# EAGLE design nitwhips_v1.0a (EAGLE 5.09)
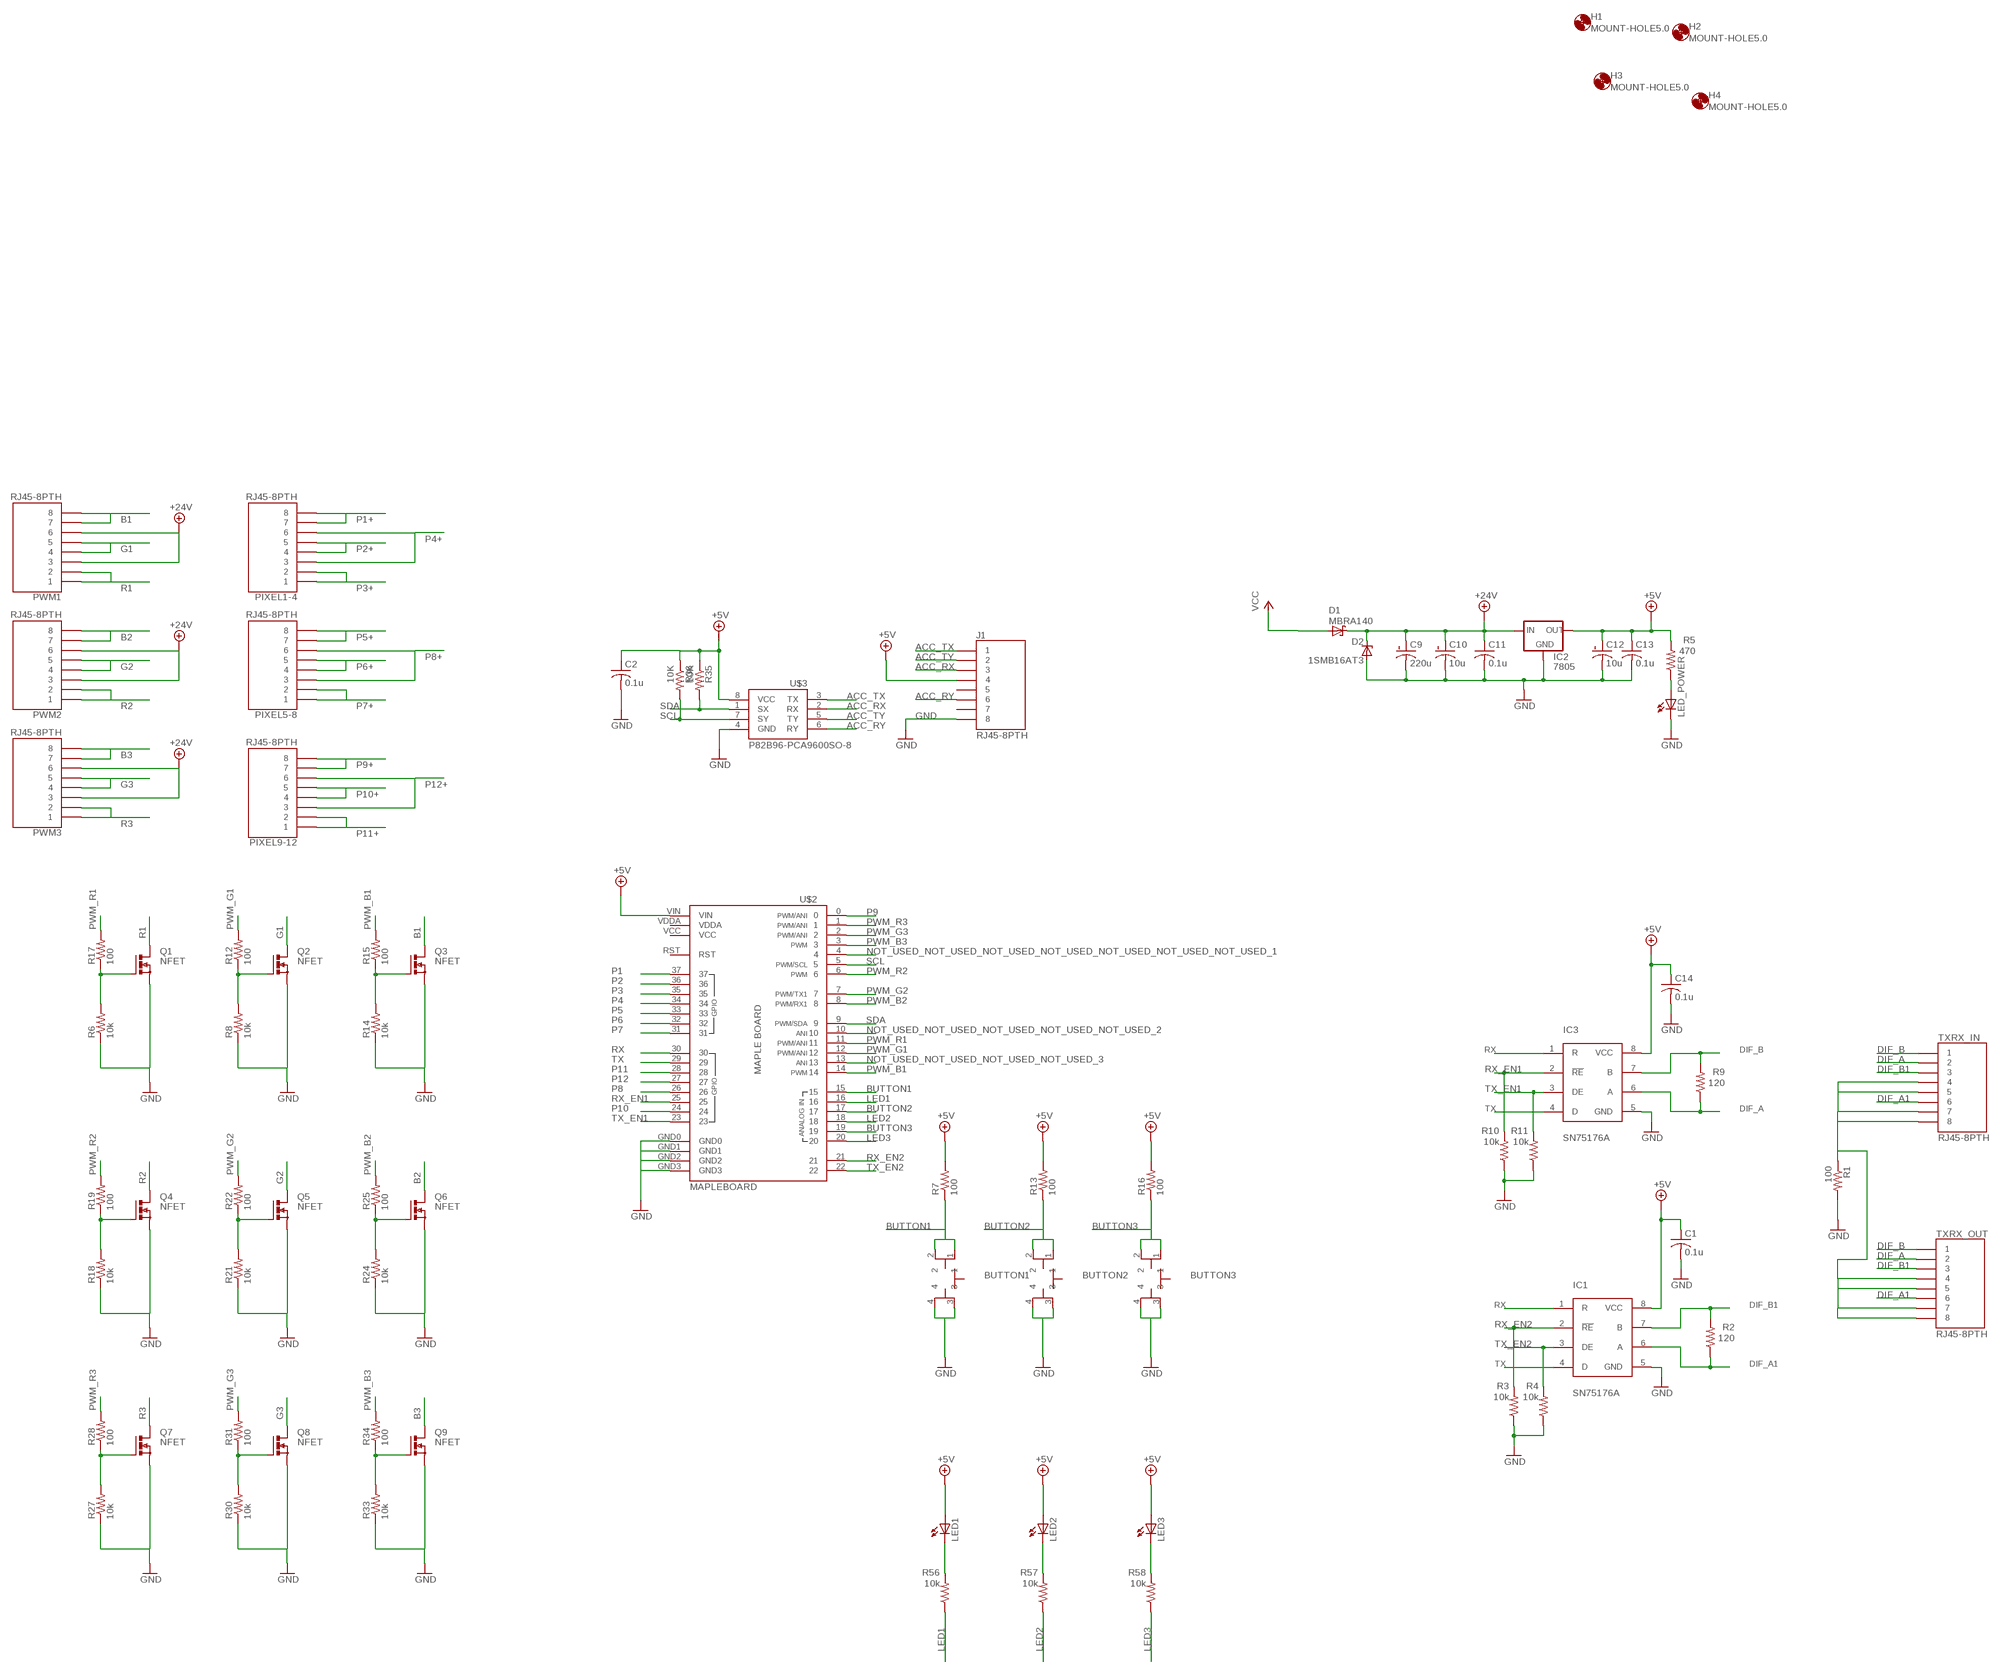
[diagram p0: schematic, sheet 1, part 1 of 2]
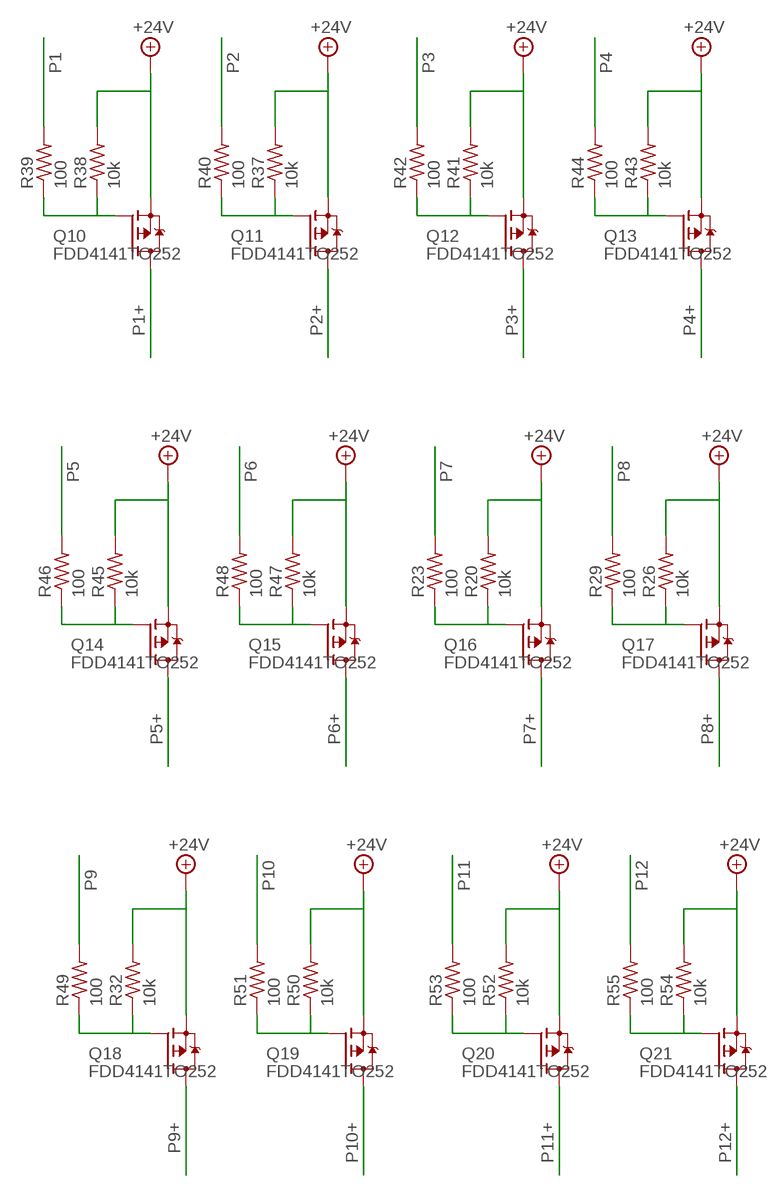
[diagram p1: schematic, sheet 1, part 2 of 2]

## Parts
BUTTON1  TL3301  [TL3301]
BUTTON2  TL3301  [TL3301]
BUTTON3  TL3301  [TL3301]
C1  0.1u  C-USC0805  [C0805]
C2  0.1u  C-USC0805  [C0805]
C9  220u  CPOL-USG  [PANASONIC_G]
C10  10u  CPOL-USCT6032  [CT6032]
C11  0.1u  C-USC0805  [C0805]
C12  10u  CPOL-USCT6032  [CT6032]
C13  0.1u  C-USC0805  [C0805]
C14  0.1u  C-USC0805  [C0805]
D1  MBRA140  [SMA]
D2  1SMB16AT3  ZENER-DIODESMB  [SMB]
H1  MOUNT-HOLE5.0  [5,0]
H2  MOUNT-HOLE5.0  [5,0]
H3  MOUNT-HOLE5.0  [5,0]
H4  MOUNT-HOLE5.0  [5,0]
IC1  SN75176A  [SO-08]
IC2  7805  LP2950CDT-5.0  [DPACK]
IC3  SN75176A  [SO-08]
J1  RJ45-8PTH  [RJ45-8]
LED1  LEDCHIP-LED0805  [CHIP-LED0805]
LED2  LEDCHIP-LED0805  [CHIP-LED0805]
LED3  LEDCHIP-LED0805  [CHIP-LED0805]
LED_POWER  LEDCHIP-LED0805  [CHIP-LED0805]
PIXEL1-4  RJ45-8PTH  [RJ45-8]
PIXEL5-8  RJ45-8PTH  [RJ45-8]
PIXEL9-12  RJ45-8PTH  [RJ45-8]
PWM1  RJ45-8PTH  [RJ45-8]
PWM2  RJ45-8PTH  [RJ45-8]
PWM3  RJ45-8PTH  [RJ45-8]
Q1  NFET  [TO252]
Q2  NFET  [TO252]
Q3  NFET  [TO252]
Q4  NFET  [TO252]
Q5  NFET  [TO252]
Q6  NFET  [TO252]
Q7  NFET  [TO252]
Q8  NFET  [TO252]
Q9  NFET  [TO252]
Q10  FDD4141TO252  [TO252]
Q11  FDD4141TO252  [TO252]
Q12  FDD4141TO252  [TO252]
Q13  FDD4141TO252  [TO252]
Q14  FDD4141TO252  [TO252]
Q15  FDD4141TO252  [TO252]
Q16  FDD4141TO252  [TO252]
Q17  FDD4141TO252  [TO252]
Q18  FDD4141TO252  [TO252]
Q19  FDD4141TO252  [TO252]
Q20  FDD4141TO252  [TO252]
Q21  FDD4141TO252  [TO252]
R1  100  R-US_R2512  [R2512]
R2  120  R-US_R0805  [R0805]
R3  10k  R-US_R0805  [R0805]
R4  10k  R-US_R0805  [R0805]
R5  470  R-US_R0805  [R0805]
R6  10k  R-US_R0603  [R0603]
R7  100  R-US_R0603  [R0603]
R8  10k  R-US_R0603  [R0603]
R9  120  R-US_R0805  [R0805]
R10  10k  R-US_R0805  [R0805]
R11  10k  R-US_R0805  [R0805]
R12  100  R-US_R0603  [R0603]
R13  100  R-US_R0603  [R0603]
R14  10k  R-US_R0603  [R0603]
R15  100  R-US_R0603  [R0603]
R16  100  R-US_R0603  [R0603]
R17  100  R-US_R0603  [R0603]
R18  10k  R-US_R0603  [R0603]
R19  100  R-US_R0603  [R0603]
R20  10k  R-US_R0603  [R0603]
R21  10k  R-US_R0603  [R0603]
R22  100  R-US_R0603  [R0603]
R23  100  R-US_R0603  [R0603]
R24  10k  R-US_R0603  [R0603]
R25  100  R-US_R0603  [R0603]
R26  10k  R-US_R0603  [R0603]
R27  10k  R-US_R0603  [R0603]
R28  100  R-US_R0603  [R0603]
R29  100  R-US_R0603  [R0603]
R30  10k  R-US_R0603  [R0603]
R31  100  R-US_R0603  [R0603]
R32  10k  R-US_R0603  [R0603]
R33  10k  R-US_R0603  [R0603]
R34  100  R-US_R0603  [R0603]
R35  10K  R-US_R0603  [R0603]
R36  10K  R-US_R0603  [R0603]
R37  10k  R-US_R0603  [R0603]
R38  10k  R-US_R0603  [R0603]
R39  100  R-US_R0603  [R0603]
R40  100  R-US_R0603  [R0603]
R41  10k  R-US_R0603  [R0603]
R42  100  R-US_R0603  [R0603]
R43  10k  R-US_R0603  [R0603]
R44  100  R-US_R0603  [R0603]
R45  10k  R-US_R0603  [R0603]
R46  100  R-US_R0603  [R0603]
R47  10k  R-US_R0603  [R0603]
R48  100  R-US_R0603  [R0603]
R49  100  R-US_R0603  [R0603]
R50  10k  R-US_R0603  [R0603]
R51  100  R-US_R0603  [R0603]
R52  10k  R-US_R0603  [R0603]
R53  100  R-US_R0603  [R0603]
R54  10k  R-US_R0603  [R0603]
R55  100  R-US_R0603  [R0603]
R56  10k  R-US_R0805  [R0805]
R57  10k  R-US_R0805  [R0805]
R58  10k  R-US_R0805  [R0805]
TXRX_IN  RJ45-8PTH  [RJ45-8]
TXRX_OUT  RJ45-8PTH  [RJ45-8]
U$2  MAPLEBOARD  [MAPLEBOARD]
U$3  P82B96-PCA9600SO-8  [SO-8]

## Nets
+5V: C1.1 C2.1 C12.+ C13.1 C14.1 IC1.8(VCC) IC2.3(OUT) IC3.8(VCC) J1.4 LED1.A LED2.A LED3.A R5.2 R7.2 R13.2 R16.2 R35.1 R36.1 U$2.VIN U$3.8(VCC)
+24V: C9.+ C10.+ C11.1 D1.K(C) D2.C IC2.1(IN) PWM1.3 PWM1.6 PWM2.3 PWM2.6 PWM3.3 PWM3.6 Q10.3(S) Q11.3(S) Q12.3(S) Q13.3(S) Q14.3(S) Q15.3(S) Q16.3(S) Q17.3(S) Q18.3(S) Q19.3(S) Q20.3(S) Q21.3(S) R20.2 R26.2 R32.2 R37.2 R38.2 R41.2 R43.2 R45.2 R47.2 R50.2 R52.2 R54.2
ACC_RX: J1.3 U$3.2(RX)
ACC_RY: J1.6 U$3.6(RY)
ACC_TX: J1.1 U$3.3(TX)
ACC_TY: J1.2 U$3.5(TY)
B1: PWM1.7 PWM1.8 Q3.2(D)
B2: PWM2.7 PWM2.8 Q6.2(D)
B3: PWM3.7 PWM3.8 Q9.2(D)
BUTTON1: BUTTON1.1 BUTTON1.2 R7.1 U$2.15
BUTTON2: BUTTON2.1 BUTTON2.2 R13.1 U$2.17
BUTTON3: BUTTON3.1 BUTTON3.2 R16.1 U$2.19
DIF_A: IC3.6(A) R9.1 TXRX_IN.2 TXRX_OUT.2
DIF_A1: IC1.6(A) R2.1 TXRX_IN.6 TXRX_OUT.6
DIF_B: IC3.7(B) R9.2 TXRX_IN.1 TXRX_OUT.1
DIF_B1: IC1.7(B) R2.2 TXRX_IN.3 TXRX_OUT.3
G1: PWM1.4 PWM1.5 Q2.2(D)
G2: PWM2.4 PWM2.5 Q5.2(D)
G3: PWM3.4 PWM3.5 Q8.2(D)
GND: BUTTON1.3 BUTTON1.4 BUTTON2.3 BUTTON2.4 BUTTON3.3 BUTTON3.4 C1.2 C2.2 C9.- C10.- C11.2 C12.- C13.2 C14.2 D2.A IC1.5(GND) IC2.4(GND) IC3.5(GND) J1.8 LED_POWER.C Q1.3(S) Q2.3(S) Q3.3(S) Q4.3(S) Q5.3(S) Q6.3(S) Q7.3(S) Q8.3(S) Q9.3(S) R1.2 R3.1 R4.1 R6.1 R8.1 R10.1 R11.1 R14.1 R18.1 R21.1 R24.1 R27.1 R30.1 R33.1 U$2.GND0 U$2.GND1 U$2.GND2 U$2.GND3 U$3.4(GND)
LED1: R56.1 U$2.16
LED2: R57.1 U$2.18
LED3: R58.1 U$2.20
N$1: LED_POWER.A R5.1
N$2: Q2.1(G) R8.2 R12.1
N$3: Q18.1(G) R32.1 R49.1
N$4: R1.1 TXRX_IN.4 TXRX_IN.5 TXRX_IN.7 TXRX_IN.8 TXRX_OUT.4 TXRX_OUT.5 TXRX_OUT.7 TXRX_OUT.8
N$6: Q19.1(G) R50.1 R51.1
N$8: Q3.1(G) R14.2 R15.1
N$9: Q20.1(G) R52.1 R53.1
N$10: Q4.1(G) R18.2 R19.1
N$11: LED1.C R56.2
N$12: Q5.1(G) R21.2 R22.1
N$13: Q16.1(G) R20.1 R23.1
N$14: Q6.1(G) R24.2 R25.1
N$15: Q17.1(G) R26.1 R29.1
N$16: Q7.1(G) R27.2 R28.1
N$17: Q21.1(G) R54.1 R55.1
N$18: Q8.1(G) R30.2 R31.1
N$19: Q1.1(G) R6.2 R17.1
N$20: LED2.C R57.2
N$21: Q9.1(G) R33.2 R34.1
N$22: Q11.1(G) R37.1 R40.1
N$23: Q12.1(G) R41.1 R42.1
N$24: Q10.1(G) R38.1 R39.1
N$25: Q13.1(G) R43.1 R44.1
N$26: Q14.1(G) R45.1 R46.1
N$27: Q15.1(G) R47.1 R48.1
N$28: LED3.C R58.2
NOT_USED_NOT_USED_NOT_USED_NOT_USED_3: U$2.13
NOT_USED_NOT_USED_NOT_USED_NOT_USED_NOT_USED_2: U$2.10
NOT_USED_NOT_USED_NOT_USED_NOT_USED_NOT_USED_NOT_USED_NOT_USED_1: U$2.4
P1: R39.2 U$2.37
P1+: PIXEL1-4.7 PIXEL1-4.8 Q10.2(D)
P2: R40.2 U$2.36
P2+: PIXEL1-4.4 PIXEL1-4.5 Q11.2(D)
P3: R42.2 U$2.35
P3+: PIXEL1-4.1 PIXEL1-4.2 Q12.2(D)
P4: R44.2 U$2.34
P4+: PIXEL1-4.3 PIXEL1-4.6 Q13.2(D)
P5: R46.2 U$2.33
P5+: PIXEL5-8.7 PIXEL5-8.8 Q14.2(D)
P6: R48.2 U$2.32
P6+: PIXEL5-8.4 PIXEL5-8.5 Q15.2(D)
P7: R23.2 U$2.31
P7+: PIXEL5-8.1 PIXEL5-8.2 Q16.2(D)
P8: R29.2 U$2.26
P8+: PIXEL5-8.3 PIXEL5-8.6 Q17.2(D)
P9: R49.2 U$2.0
P9+: PIXEL9-12.7 PIXEL9-12.8 Q18.2(D)
P10: R51.2 U$2.24
P10+: PIXEL9-12.4 PIXEL9-12.5 Q19.2(D)
P11: R53.2 U$2.28
P11+: PIXEL9-12.1 PIXEL9-12.2 Q20.2(D)
P12: R55.2 U$2.27
P12+: PIXEL9-12.3 PIXEL9-12.6 Q21.2(D)
PWM_B1: R15.2 U$2.14
PWM_B2: R25.2 U$2.8
PWM_B3: R34.2 U$2.3
PWM_G1: R12.2 U$2.12
PWM_G2: R22.2 U$2.7
PWM_G3: R31.2 U$2.2
PWM_R1: R17.2 U$2.11
PWM_R2: R19.2 U$2.6
PWM_R3: R28.2 U$2.1
R1: PWM1.1 PWM1.2 Q1.2(D)
R2: PWM2.1 PWM2.2 Q4.2(D)
R3: PWM3.1 PWM3.2 Q7.2(D)
RX: IC1.1(R) IC3.1(R) U$2.30
RX_EN1: IC3.2(!RE) R10.2 U$2.25
RX_EN2: IC1.2(!RE) R3.2 U$2.21
SCL: R36.2 U$2.5 U$3.7(SY)
SDA: R35.2 U$2.9 U$3.1(SX)
TX: IC1.4(D) IC3.4(D) U$2.29
TX_EN1: IC3.3(DE) R11.2 U$2.23
TX_EN2: IC1.3(DE) R4.2 U$2.22
VCC: D1.A
Unconnected: J1.5 J1.7 U$2.RST U$2.VCC U$2.VDDA

## Library data of the parts
BUTTON1-BUTTON3 = E-switch:TL3301
C1 C2 C11 C13 C14 = rcl:C-US: CAPACITOR, American symbol
C9 C10 C12 = rcl:CPOL-US: POLARIZED CAPACITOR, American symbol
D1 = diode:MBRA140
D2 = diode:ZENER-DIODE: Z-Diode
H1-H4 = holes:MOUNT-HOLE: MOUNTING HOLE with drill center marker
IC1 IC3 = texas:SN75176A: Transceiver RS422
IC2 = v-reg:LP2950?*: Source: http://cache.national.com/ds/LP/LP2950.pdf
J1 PIXEL1-4 PIXEL5-8 PIXEL9-12 PWM1-PWM3 TXRX_IN TXRX_OUT = SparkFun:RJ45-8: RJ45 Jack Simple RJ45, 8-pin connection - connector for common Cat5, Cat5e, and Cat6 Ethernet cables. Footprint not yet proven in production. Connector sku is PRT-00643; Breakout PCB sku is BOB-00716.
LED1-LED3 LED_POWER = led:LED: LED OSRAM: - CHIPLED LG R971, LG N971, LY N971, LG Q971, LY Q971, LO R971, LY R971 LH N974, LH R974 LS Q976, LO Q976, LY Q976 LO Q996 - Hyper CHIPLED LW Q18S LB Q993, LB Q99A, LB R99A - SideLED LS A670, LO A670, LY A670, LG A670, LP A670 LB A673, LV A673, LT A673, LW A673 LH A674 LY A675 LS A676, LA A676, LO A676, LY A676, LW A676 LS A679, LY A679, LG A679 - Hyper Micro SIDELED® LS Y876, LA Y876, LO Y876, LY Y876 LT Y87S - SmartLED LW L88C, LW L88S LB L89C, LB L89S, LG L890 LS L89K, LO L89K, LY L89K LS L896, LA L896, LO L896, LY L896 - TOPLED LS T670, LO T670, LY T670, LG T670, LP T670 LSG T670, LSP T670, LSY T670, LOP T670, LYG T670 LG T671, LOG T671, LSG T671 LB T673, LV T673, LT T673, LW T673 LH T674 LS T676, LA T676, LO T676, LY T676, LB T676, LH T676, LSB T676, LW T676 LB T67C, LV T67C, LT T67C, LS T67K, LO T67K, LY T67K, LW E67C LS E67B, LA E67B, LO E67B, LY E67B, LB E67C, LV E67C, LT E67C LW T67C LS T679, LY T679, LG T679 LS T770, LO T770, LY T770, LG T770, LP T770 LB T773, LV T773, LT T773, LW T773 LH T774 LS E675, LA E675, LY E675, LS T675 LS T776, LA T776, LO T776, LY T776, LB T776 LHGB T686 LT T68C, LB T68C - Hyper Mini TOPLED® LB M676 - Mini TOPLED Santana® LG M470 LS M47K, LO M47K, LY M47K Source: http://www.osram.convergy.de LUXEON: - LUMILED® LXK2-PW12-R00, LXK2-PW12-S00, LXK2-PW14-U00, LXK2-PW14-V00 LXK2-PM12-R00, LXK2-PM12-S00, LXK2-PM14-U00 LXK2-PE12-Q00, LXK2-PE12-R00, LXK2-PE12-S00, LXK2-PE14-T00, LXK2-PE14-U00 LXK2-PB12-K00, LXK2-PB12-L00, LXK2-PB12-M00, LXK2-PB14-N00, LXK2-PB14-P00, LXK2-PB14-Q00 LXK2-PR12-L00, LXK2-PR12-M00, LXK2-PR14-Q00, LXK2-PR14-R00 LXK2-PD12-Q00, LXK2-PD12-R00, LXK2-PD12-S00 LXK2-PH12-R00, LXK2-PH12-S00 LXK2-PL12-P00, LXK2-PL12-Q00, LXK2-PL12-R00 Source: www.luxeon.com KINGBRIGHT: KA-3528ASYC Source: www.kingbright.com
Q1-Q9 = vincent:NFET
Q10-Q21 = transistor-fet:FDD4141: P-Channel PowerTrench® MOSFET Source: FDD4141.pdf
R1-R58 = rcl:R-US_: RESISTOR, American symbol
U$2 = NITWHIPS:MAPLEBOARD
U$3 = Sparky:P82B96-PCA9600: P822B96 and PCA9600, bipolar IC creating a non-latching, bidirectional, logic interface between the normal I2C bus and a range of other bus configuration icluding rs485.

## Board
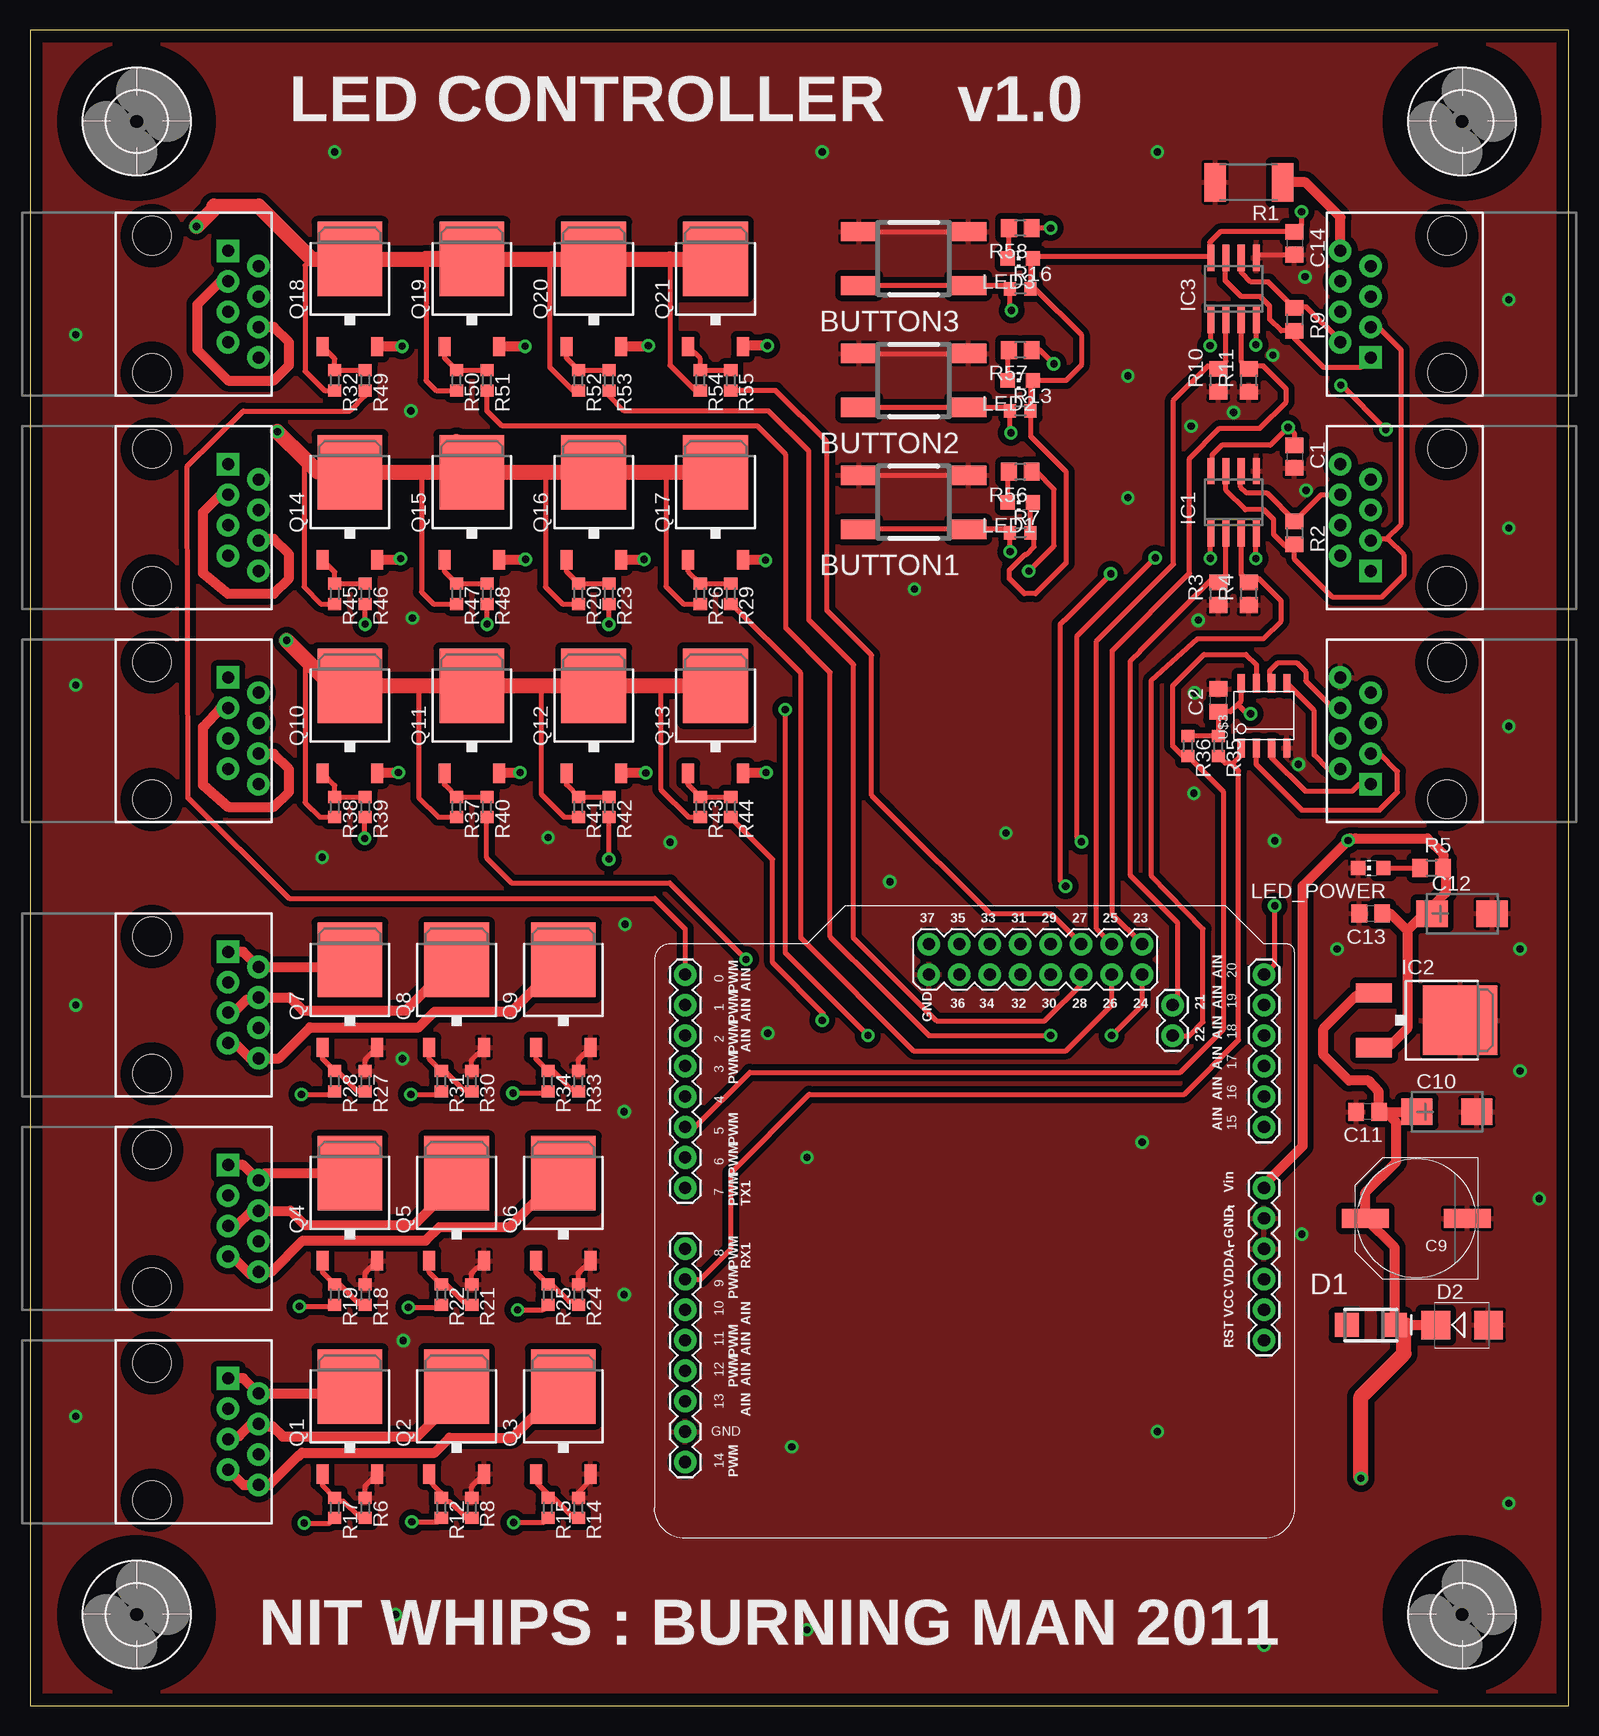
[diagram p2: board, top side]
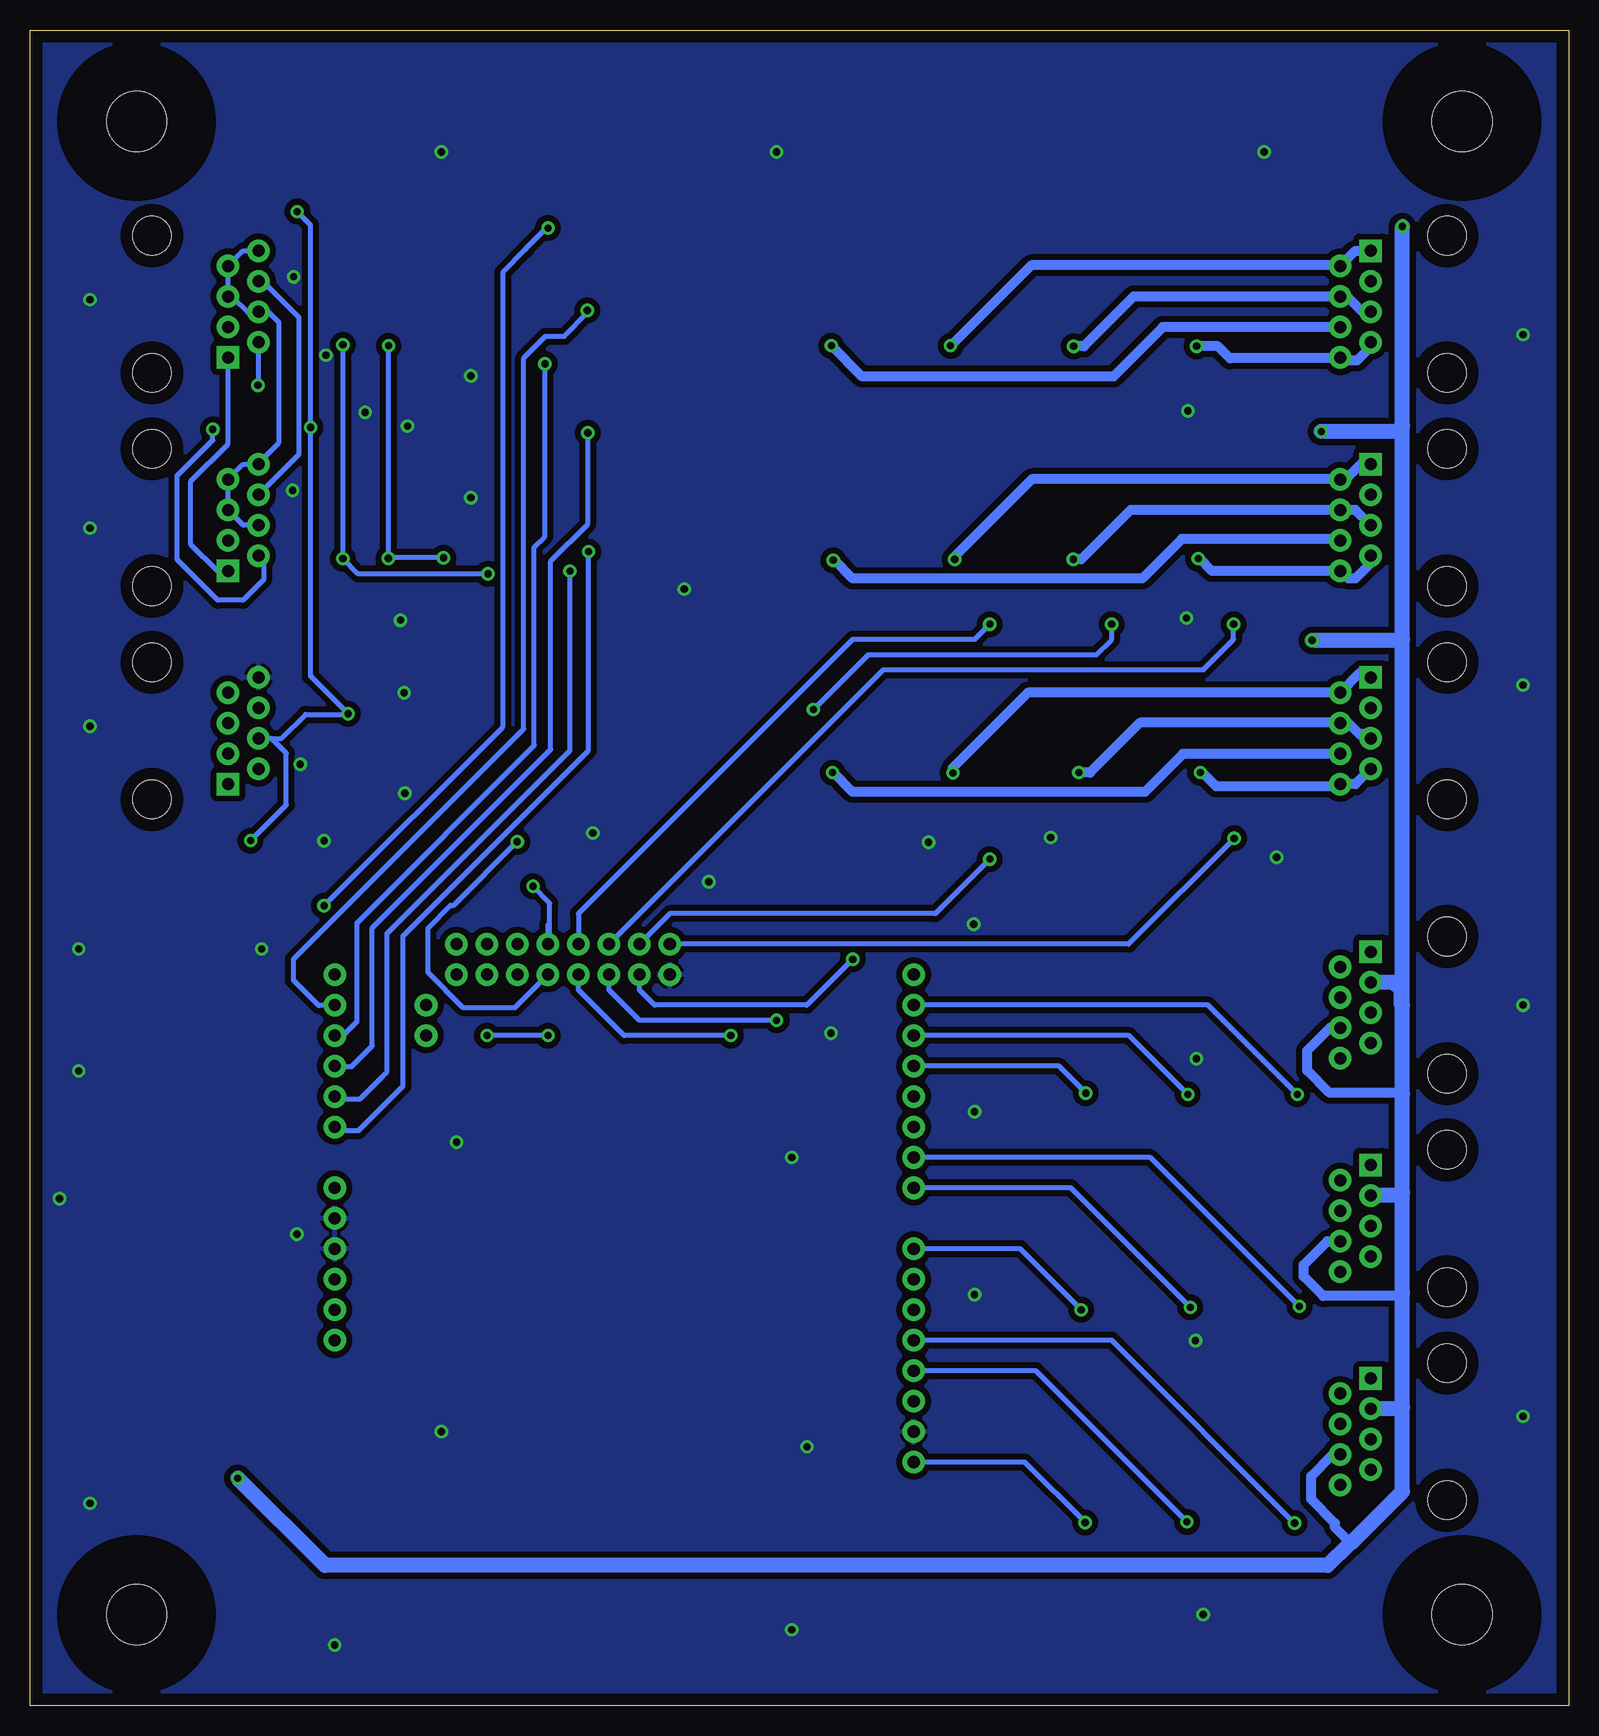
[diagram p3: board, bottom side, seen from below]

Size 128.27 x 139.7 mm. Coordinates in mm from the lower left corner, seen from the top.
Outline: 0,0 128.27,0 128.27,139.7 0,139.7 0,0
Copper layers (1*2+15*16): Top 0.0356mm / dielectric 0.5004mm / Route2 0.0356mm / dielectric 0.5004mm / Route15 0.0356mm / dielectric 0.5004mm / Bottom 0.0356mm
Design rules "ESKI_design_rules": minimum track width 8mil, minimum drill 15mil, track to track 7mil, track to pad 7mil, pad to pad 7mil, via to via 7mil, smd to smd 6mil, copper to edge 40mil, drill to drill 8mil, minimum pad ring 10mil, minimum via ring 10mil, stop-mask expansion 4mil, vias tented up to drill 50mil, thermal gap 10mil

### Footprints (pad centres in the part's own frame; a part is rotated, then mirrored left to right if it is on the bottom)
TL3301 = smd 3 x 1.6: 1 -4.55,2.25; 2 4.55,2.25; 3 -4.55,-2.25; 4 4.55,-2.25
C0805 = smd 1.3 x 1.5: 1 -0.95,0; 2 0.95,0
PANASONIC_G = smd 3.9 x 1.6: + 4.25,0; - -4.25,0
CT6032 = smd 2.6 x 2.2: + -2.5,0; - 2.5,0
SMA = smd 1.999 x 1.999: A -1.994,0; K 1.994,0
SMB = smd 2.4 x 2.4: A 2.2,0; C -2.2,0
5,0 = hole 5: 0,0
SO-08 = smd 0.6 x 2.2: 1 -1.905,-2.6; 2 -0.635,-2.6; 3 0.635,-2.6; 4 1.905,-2.6; 5 1.905,2.6; 6 0.635,2.6; 7 -0.635,2.6; 8 -1.905,2.6
DPACK = smd 1.6 x 3: 1 -2.28,-4.8; 3 2.28,-4.8 | smd 5.8 x 6.2: 4 0,2.38
RJ45-8 = drill 1 pad 1.88 square: 1 -4.445,6.35 | drill 1 pad 1.88 round: 2 -3.175,8.89; 3 -1.905,6.35; 4 -0.635,8.89; 5 0.635,6.35; 6 1.905,8.89; 7 3.175,6.35; 8 4.445,8.89 | hole 3.2: -5.715,0; 5.715,0
CHIP-LED0805 = smd 1.2 x 1.2: A 0,-1.05; C 0,1.05
TO252 = smd 1 x 1.6: 1 -2.28,-4.8; 3 2.28,-4.8 | smd 5.4 x 6.2: 2 0,2.5
TO252' = smd 1 x 1.6: 1 -2.28,-4.8; 2 2.28,-4.8 | smd 5.4 x 6.2: 3 0,2.5
R2512 = smd 1.8 x 3.2: 1 -2.8,0; 2 2.8,0
R0805 = smd 1.3 x 1.5: 1 -0.95,0; 2 0.95,0
R0603 = smd 1 x 1.1: 1 -0.85,0; 2 0.85,0
MAPLEBOARD = drill 1.016 pad 1.88 round: 0 46.99,50.8; 1 44.45,50.8; 2 41.91,50.8; 3 39.37,50.8; 4 36.83,50.8; 5 34.29,50.8; 6 31.75,50.8; 7 29.21,50.8; 8 24.13,50.8; 9 21.59,50.8; 10 19.05,50.8; 11 16.51,50.8; 12 13.97,50.8; 13 11.43,50.8; 14 6.35,50.8; 15 34.29,2.54; 16 36.83,2.54; 17 39.37,2.54; 18 41.91,2.54; 19 44.45,2.54; 20 46.99,2.54; 21 44.45,10.16; 22 41.91,10.16; 23 49.53,12.7; 24 46.99,12.7; 25 49.53,15.24; 26 46.99,15.24; 27 49.53,17.78; 28 46.99,17.78; 29 49.53,20.32; 30 46.99,20.32; 31 49.53,22.86; 32 46.99,22.86; 33 49.53,25.4; 34 46.99,25.4; 35 49.53,27.94; 36 46.99,27.94; 37 49.53,30.48; GND0 8.89,50.8; GND1 46.99,30.48; GND2 26.67,2.54; GND3 24.13,2.54; RST 16.51,2.54; VCC 19.05,2.54; VDDA 21.59,2.54; VIN 29.21,2.54
SO-8 = smd 0.6 x 1.55: 1 -1.905,-2.7; 2 -0.635,-2.7; 3 0.635,-2.7; 4 1.905,-2.7; 5 1.905,2.7; 6 0.635,2.7; 7 -0.635,2.7; 8 -1.905,2.7

### Placement (x,y rotation side)
BUTTON1  73.66,100.33 180 top
BUTTON2  73.66,110.49 180 top
BUTTON3  73.66,120.65 180 top
C1  105.41,104.14 270 top
C2  99.06,83.82 90 top
C9  115.57,40.64 180 top
C10  118.11,49.53 0 top
C11  111.51,49.53 180 top
C12  119.38,66.04 0 top
C13  111.76,66.04 180 top
C14  105.41,121.92 270 top
D1  111.76,31.75 0 top
D2  119.38,31.75 0 top
H1  8.89,7.62 0 top
H2  119.38,7.62 0 top
H3  8.89,132.08 0 top
H4  119.38,132.08 0 top
IC1  100.33,100.33 0 top
IC2  116.84,57.15 270 top
IC3  100.33,118.11 0 top
J1  118.11,81.28 90 top
LED1  82.55,100.33 90 top
LED2  82.55,110.49 90 top
LED3  82.55,120.65 90 top
LED_POWER  111.76,69.85 90 top
PIXEL1-4  10.16,81.28 270 top
PIXEL5-8  10.16,99.06 270 top
PIXEL9-12  10.16,116.84 270 top
PWM1  10.16,22.86 270 top
PWM2  10.16,40.64 270 top
PWM3  10.16,58.42 270 top
Q1  26.67,24.13 0 top
Q2  35.56,24.13 0 top
Q3  44.45,24.13 0 top
Q4  26.67,41.91 0 top
Q5  35.56,41.91 0 top
Q6  44.45,41.91 0 top
Q7  26.67,59.69 0 top
Q8  35.56,59.69 0 top
Q9  44.45,59.69 0 top
Q10  FDD4141TO252  [TO252']  26.67,82.55 0 top
Q11  FDD4141TO252  [TO252']  36.83,82.55 0 top
Q12  FDD4141TO252  [TO252']  46.99,82.55 0 top
Q13  FDD4141TO252  [TO252']  57.15,82.55 0 top
Q14  FDD4141TO252  [TO252']  26.67,100.33 0 top
Q15  FDD4141TO252  [TO252']  36.83,100.33 0 top
Q16  FDD4141TO252  [TO252']  46.99,100.33 0 top
Q17  FDD4141TO252  [TO252']  57.15,100.33 0 top
Q18  FDD4141TO252  [TO252']  26.67,118.11 0 top
Q19  FDD4141TO252  [TO252']  36.83,118.11 0 top
Q20  FDD4141TO252  [TO252']  46.99,118.11 0 top
Q21  FDD4141TO252  [TO252']  57.15,118.11 0 top
R1  101.6,127 180 top
R2  105.41,97.79 270 top
R3  99.06,92.71 90 top
R4  101.6,92.71 90 top
R5  116.84,69.85 0 top
R6  27.94,16.51 270 top
R7  82.55,97.79 0 top
R8  36.83,16.51 270 top
R9  105.41,115.57 270 top
R10  99.06,110.49 90 top
R11  101.6,110.49 90 top
R12  34.29,16.51 270 top
R13  82.55,107.95 0 top
R14  45.72,16.51 270 top
R15  43.18,16.51 270 top
R16  82.55,118.11 0 top
R17  25.4,16.51 270 top
R18  27.94,34.29 270 top
R19  25.4,34.29 270 top
R20  45.72,92.71 270 top
R21  36.83,34.29 270 top
R22  34.29,34.29 270 top
R23  48.26,92.71 270 top
R24  45.72,34.29 270 top
R25  43.18,34.29 270 top
R26  55.88,92.71 270 top
R27  27.94,52.07 270 top
R28  25.4,52.07 270 top
R29  58.42,92.71 270 top
R30  36.83,52.07 270 top
R31  34.29,52.07 270 top
R32  25.4,110.49 270 top
R33  45.72,52.07 270 top
R34  43.18,52.07 270 top
R35  99.06,80.01 270 top
R36  96.52,80.01 270 top
R37  35.56,74.93 270 top
R38  25.4,74.93 270 top
R39  27.94,74.93 270 top
R40  38.1,74.93 270 top
R41  45.72,74.93 270 top
R42  48.26,74.93 270 top
R43  55.88,74.93 270 top
R44  58.42,74.93 270 top
R45  25.4,92.71 270 top
R46  27.94,92.71 270 top
R47  35.56,92.71 270 top
R48  38.1,92.71 270 top
R49  27.94,110.49 270 top
R50  35.56,110.49 270 top
R51  38.1,110.49 270 top
R52  45.72,110.49 270 top
R53  48.26,110.49 270 top
R54  55.88,110.49 270 top
R55  58.42,110.49 270 top
R56  82.55,102.87 180 top
R57  82.55,113.03 180 top
R58  82.55,123.19 180 top
TXRX_IN  118.11,116.84 90 top
TXRX_OUT  118.11,99.06 90 top
U$2  105.41,13.97 90 top
U$3  102.87,82.55 0 top

### Tracks (layer width: path | path; a pad name or v marks a point on that pad's centre or on a via)
+5V  (via drill 0.6)
  Top 0.406: 98.35,120.79 98.35,122 99.22,122.87 C14.1 105.99,123.45 v105.99,124.56 | 98.35,120.79 IC3.8 | R36.1 R35.1 C2.1 100.07,82.87 100.67,83.48 | 100.67,83.48 100.97,83.77 U$3.8 | v101.75,82.7 101.45,82.7 100.67,83.48 | LED1.A 83.82,100.33 83.4,99.91 R7.2 83.69,97.5 83.69,96.6 83.08,95.99 82.96,95.99 81.64,94.67 81.64,93.96 82.88,92.71 83.82,92.71 86.36,95.25 86.36,102.87 83.4,105.83 R13.2 83.4,110.29 LED2.A 86.36,110.49 87.63,111.76 87.63,114.3 83.82,118.11 R16.2 83.4,120.45 LED3.A 83.74,120.79 98.35,120.79 | IC1.8 98.53,103.03 98.53,104.27 99.35,105.09 103.39,105.09 v104.88,106.58 105.41,106.04 C1.1 | v109.88,72.14 110.31,72.14 110.49,72.31
  Top 0.813: 111.7,54.87 IC2.3 112.34,55.17 113.51,55.17 114.81,56.46 114.81,64.62 | C13.1 113.39,66.04 114.81,64.62 | 114.81,64.62 116.23,66.04 C12.+ 116.88,66.64 118.03,67.79 118.03,69.32 | 118.03,69.32 118.03,69.61 R5.2 | U$2.VIN 102.87,43.43 106.1,46.66 106.1,68.35 v109.88,72.14 110.06,72.31 110.49,72.31 116.48,72.31 117.81,70.99 117.81,69.55 118.03,69.32
  Bottom 0.406: v105.99,124.56 104.88,123.44 v104.88,106.58 104.88,85.83 v101.75,82.7 101.8,82.65 105.31,82.65 107.31,80.65 J1.4 108.13,80.65 106.91,79.43 106.91,75.11 v109.88,72.14
+24V  (via drill 0.6)
  Top 0.406: 35.56,105.41 36.83,104.14 36.83,104.1 38.1,102.83 | R52.2 45.28,109.64 43.33,111.58 43.33,120.43 43.51,120.61 | R54.2 55.46,109.64 53.34,111.76 53.34,120.61 53.34,120.65 | R32.2 24.55,109.64 22.94,111.25 22.94,120.06 23.48,120.61 | R50.2 33.87,109.64 33.02,110.49 33.02,120.65 | R45.2 24.24,91.86 22.83,93.27 22.83,103.81 22.94,103.91 | R47.2 33.64,91.86 32.64,92.86 32.64,102.97 32.79,103.12 38.31,103.12 38.61,102.83 | R20.2 44.39,91.86 42.98,93.27 42.98,102.35 43.46,102.83 | R26.2 54.47,91.86 53.01,93.32 53.01,102.5 53.34,102.83 | R38.2 24.17,74.08 22.94,75.31 22.94,87.27 22.57,87.64 | R37.2 34.05,74.08 32.41,75.72 32.41,84.97 32.49,85.05 | R41.2 44.54,74.08 42.62,76 42.62,84.53 43.18,85.09 43.18,85.05 | R43.2 54.9,74.08 52.58,76.4 52.58,84.85 52.78,85.05
  Top 0.813: D2.C 114.73,31.75 D1.K 113.75,38.21 C9.+ 111.32,42.79 113.89,45.36 113.89,48.67 113.03,49.53 C11.1 | C11.1 C10.+ | C11.1 112.43,51.2 111.58,52.12 109.96,52.12 107.82,54.25 107.82,56.46 110.57,59.21 111.82,59.21 IC2.1
  Top 1.27: Q20.3 53.34,120.61 Q21.3 | 45.76,120.61 Q20.3 | 45.76,120.61 45.72,120.65 46.95,120.65 Q20.3 | Q19.3 43.51,120.61 45.76,120.61 | Q17.3 53.34,102.83 Q16.3 43.46,102.83 35.56,102.83 | 38.61,102.83 38.1,102.83 36.87,102.83 36.83,102.87 Q15.3 | Q14.3 26.71,102.87 25.4,102.87 | Q13.3 52.78,85.05 Q12.3 43.18,85.05 Q11.3 32.49,85.05 Q10.3 25.16,85.05 22.57,87.64 v21.39,88.82 | v13.87,123.32 15.32,124.76 15.32,125.02 19.07,125.02 23.48,120.61 Q18.3 Q19.3 | 33.02,120.65 36.79,120.65 Q19.3 | 25.4,102.87 23.98,102.87 22.94,103.91 v20.62,106.22 | 35.56,102.83 25.44,102.83 25.4,102.87 | 35.56,102.83 35.56,105.41 | v110.95,18.97 110.95,25.78 114.53,29.36 114.53,31.55 114.73,31.75
  Bottom 0.813: PWM2.6 20.14,38.73 22.1,36.78 22.1,35.79 20.47,34.16 14.17,34.16 13.87,34.47 | PWM1.6 19.66,20.95 21.46,19.15 21.46,17.22 19.48,15.24 19.48,14.88 18.16,13.56 | PWM3.6 19.91,56.52 21.79,54.63 21.79,52.96 19.94,51.1 13.92,51.1 13.87,51.05
  Bottom 1.27: 13.87,24.92 13.87,17.86 18.16,13.56 18.26,13.56 20.12,11.71 103.68,11.71 v110.95,18.97 | 13.87,24.92 13.87,34.47 13.87,42.8 | 13.87,42.8 13.87,51.05 13.87,58.42 | 13.87,58.42 13.87,88.9 | 13.87,88.9 13.87,106.68 | 13.87,106.68 v13.87,123.32 | v20.62,106.22 14.33,106.22 13.87,106.68 | v21.39,88.82 13.95,88.82 13.87,88.9 | PWM3.3 14.61,60.33 13.97,59.69 13.97,58.52 13.87,58.42 | PWM2.3 14.12,42.55 13.87,42.8 | PWM1.3 14.02,24.77 13.87,24.92
ACC_RX
  Top 0.406: J1.3 112.52,79.38 114,77.9 114,76.18 112.5,74.68 106.02,74.68 102.21,78.49 102.21,79.82 U$3.2
ACC_RY
  Top 0.406: J1.6 108.61,83.19 106.35,85.45 106.35,86.21 105.59,86.97 104.04,86.97 103.35,86.28 103.35,85.4 U$3.6
ACC_TX
  Top 0.406: J1.1 110.8,76.84 110.21,76.25 106.3,76.25 103.45,79.1 103.45,79.8 U$3.3
ACC_TY
  Top 0.406: J1.2 108.2,78.1 107.06,79.25 107.06,82.96 U$3.5
B1
  Top 0.813: PWM1.7 17.78,18.41 PWM1.8 19.94,18.41 22.35,20.83 22.4,20.83 22.68,21.11 33.73,21.11 34.98,22.35 40.17,22.35 Q3.2
B2
  Top 0.813: PWM2.7 16.84,37.47 18.31,35.99 18.85,35.99 PWM2.8 20.14,36.2 22.73,38.79 33,38.79 34.14,39.93 39.97,39.93 Q6.2
B3
  Top 0.813: PWM3.7 17.07,55.24 18.54,53.77 18.85,53.77 PWM3.8 20.75,53.98 23.34,56.57 32.41,56.57 33.73,57.89 40.15,57.89 Q9.2
BUTTON1  (via drill 0.6)
  Top 0.406: BUTTON1.2 BUTTON1.1 81.41,98.08 R7.1 v81.7,96.23 v81.71,96.22
  Bottom 0.406: v81.71,96.22 81.71,79.65 97.18,64.19 97.18,51.66 100.91,47.93 102.54,47.93 U$2.15
BUTTON2  (via drill 0.6)
  Top 0.406: BUTTON2.2 BUTTON2.1 81.41,108.24 R13.1 81.7,106.18 v81.76,106.12
  Bottom 0.406: v81.76,106.12 81.76,98.53 84.86,95.43 84.86,79.73 99.75,64.85 99.75,55.02 101.5,53.26 102.79,53.26 U$2.17
BUTTON3  (via drill 0.6)
  Top 0.406: BUTTON3.2 BUTTON3.1 81.41,118.4 R16.1 81.7,116.44 v81.81,116.33
  Bottom 0.406: v81.81,116.33 81.81,116.08 83.72,114.17 85.29,114.17 87.12,112.34 87.12,81.43 106.3,62.26 106.3,60.48 104.19,58.37 102.92,58.37 U$2.19
DIF_A  (via drill 0.6)
  Top 0.406: TXRX_IN.2 109.22,113.79 106.4,116.61 105.5,116.61 R9.1 103.24,118.69 101.78,118.69 100.97,119.51 IC3.6 | v109.27,110.08 109.35,110.08 v113.03,106.4
  Bottom 0.406: TXRX_IN.2 109.22,110.13 v109.27,110.08 | TXRX_OUT.2 108.76,95.43 108.76,93.93 110.52,92.18 112.62,92.18 116,95.56 116,102.54 113.03,105.51 v113.03,106.4
DIF_A1
  Top 0.406: TXRX_OUT.6 107.64,100.97 R2.1 105.41,98.81 103.1,101.12 101.4,101.12 100.91,101.6 100.91,102.88 IC1.6
  Bottom 0.406: TXRX_IN.6 108.86,118.75 105.84,115.72 105.84,104.34 TXRX_OUT.6
DIF_B
  Top 0.406: IC3.7 99.64,120.66 99.64,118.8 100.97,117.47 102.56,117.47 103.35,116.69 103.35,115.57 104.3,114.62 R9.2 105.41,114 107.85,111.56 110.92,111.56 TXRX_IN.1
  Bottom 0.406: TXRX_OUT.1 111.78,94.59 112.62,94.59 114.86,96.82 114.86,102.08 111.76,105.18 TXRX_IN.1
DIF_B1
  Top 0.406: IC1.7 99.7,101.32 101.3,99.72 102.87,99.72 103.68,98.91 103.68,97.64 104.65,96.67 105.24,96.67 R2.2 105.41,95.58 108.56,92.43 112.7,92.43 114.55,94.28 114.55,95.91 113.21,97.26 113.03,97.26 | 113.03,97.26 111.12,97.26 111.1,97.23 111.68,97.23 TXRX_OUT.3 | TXRX_IN.3 112.4,114.94 114.3,113.03 114.3,98.53 113.03,97.26
G1
  Top 0.813: Q2.2 35.56,25.7 32.31,22.45 21.06,22.45 20.19,23.32 19.23,23.32 PWM1.4 18.44,23.49 17.45,22.5 16.79,22.5 PWM1.5
G2
  Top 0.813: PWM2.5 17.2,40 18.47,41.27 PWM2.4 21.72,41.27 22.89,40.11 32.03,40.11 33.55,41.63 33.55,42.4 Q5.2
G3
  Top 0.813: PWM3.5 16.97,57.78 18.06,58.88 18.87,58.88 PWM3.4 21.67,59.05 22.76,57.96 31.33,57.96 Q8.2
GND  (via drill 0.6)
  Top 0.406: R6.1 27.94,18.32 Q1.3 | R27.1 27.94,53.88 Q7.3 | R8.1 36.83,18.32 Q2.3 | Q3.3 46.73,18.79 45.72,17.78 R14.1 | R30.1 36.83,53.88 Q8.3 | R33.1 45.72,53.88 Q9.3 | R18.1 27.94,36.1 Q4.3 | R21.1 36.83,36.1 Q5.3 | R24.1 45.72,36.1 Q6.3 | C14.2 102.5,120.97 IC3.5 | BUTTON3.4 BUTTON3.3 | BUTTON2.4 BUTTON2.3 | BUTTON1.4 BUTTON1.3 | C2.2 99.38,84.77
  other vias: 3.81,58.42 64.77,45.72 43.18,72.39 31.75,107.95 25.4,129.54 66.04,129.54 93.98,129.54 3.81,85.09 30.48,7.62 64.77,6.35 102.87,5.08 93.98,22.86 92.71,46.99 63.5,21.59 49.53,34.29 49.53,49.53 49.61,65.15 91.52,110.87 123.27,117.22 123.27,98.17 123.27,81.66 125.81,42.29 81.36,72.77 73.74,93.09 91.52,100.71 106.38,101.32 71.68,68.71 100.33,107.82 96.8,106.68 103.61,112.6 106.3,119.13 97.08,84.46 105.74,78.49 97.38,90.5 108.97,63.09 124.21,63.09 124.21,52.93 123.27,16.89 106.02,39.32 3.81,24.13 3.81,114.3 31.11,30.45 31.04,53.95 53.37,71.98 24.36,70.74 61.49,56.08 103.76,72.11 97.03,76.07 31.88,90.68
  pour Top (isolate 0.508): 0,139.7 128.27,139.7 128.27,-1.27 0,-1.27
  pour Bottom (isolate 0.508): 0,139.7 128.27,139.7 128.27,0 0,0
LED1  (via drill 0.6)
  Top 0.406: R56.1 83.92,102.87 85.37,101.42 85.37,96.7 v83.26,94.59
  Bottom 0.406: U$2.16 102.64,50.57 100.79,50.57 98.9,52.46 98.73,52.63 98.5,52.86 98.5,64.39 83.26,79.63 v83.26,94.59
LED2  (via drill 0.6)
  Top 0.406: R57.1 84.18,113.03 v85.34,111.86
  Bottom 0.406: v85.34,111.86 85.34,97.49 86.23,96.6 86.23,80.06 101.02,65.28 101.02,57.07 102.31,55.78 102.77,55.78 U$2.18
LED3  (via drill 0.6)
  Top 0.406: v85.09,123.19 R58.1 | v103.76,66.7 103.76,61.85 U$2.20
  Bottom 0.406: v85.09,123.19 85.24,123.19 86.94,121.49 86.94,121.41 88.85,119.51 88.85,81.61 v103.76,66.7
N$1
  Top 0.406: LED_POWER.A R5.1
N$2
  Top 0.406: R8.2 36.33,15.66 34.98,17.02 34.63,17.02 R12.1 34.29,17.78 33.02,19.05 33.28,19.31 Q2.1
N$3
  Top 0.406: Q18.1 25.4,112.3 R32.1 R49.1
N$4
  Top 0.813: R1.1 106.32,127 109.25,124.08 109.25,121.31 TXRX_IN.8
  Bottom 0.406: TXRX_OUT.4 110.49,98.43 TXRX_OUT.5 TXRX_OUT.7 110.49,103.5 TXRX_OUT.8 109.22,103.61 107.52,105.31 107.52,115.32 108.51,116.31 109.12,116.31 TXRX_IN.4 109.35,116.08 110.06,116.08 111.45,117.47 TXRX_IN.5 TXRX_IN.7 110.49,121.28 TXRX_IN.8
N$6
  Top 0.406: Q19.1 34.55,112.35 R50.1 R51.1
N$8
  Top 0.406: R14.2 45.33,15.66 43.69,17.3 43.24,17.3 R15.1 43.18,17.65 42.29,18.54 42.29,19.21 Q3.1
N$9
  Top 0.406: Q20.1 44.71,112.35 R52.1 R53.1
N$10
  Top 0.406: Q4.1 24.39,36.15 R19.1 25.79,35.14 27.38,33.55 27.83,33.55 R18.2
N$11
  Top 0.406: LED1.C 81.5,102.77 R56.2
N$12
  Top 0.406: Q5.1 33.28,36.15 R22.1 34.69,35.14 36.17,33.66 36.61,33.66 R21.2
N$13
  Top 0.406: Q16.1 44.71,94.57 R20.1 R23.1
N$14
  Top 0.406: Q6.1 42.17,36.15 R25.1 43.5,35.14 44.93,33.71 45.45,33.71 R24.2
N$15
  Top 0.406: Q17.1 54.87,94.57 R26.1 R29.1
N$16
  Top 0.406: Q7.1 24.39,53.93 R28.1 25.62,52.92 27.28,51.26 27.9,51.26 R27.2
N$17
  Top 0.406: R55.1 R54.1 55.88,112.3 Q21.1 54.87,113.29 54.61,113.03
N$18
  Top 0.406: Q8.1 33.28,53.93 R31.1 34.58,52.92 36.19,51.31 36.74,51.31 R30.2
N$19
  Top 0.406: Q1.1 24.39,18.37 R17.1 25.69,17.07 26.11,17.07 27.52,15.66 R6.2
N$20
  Top 0.406: LED2.C 81.5,112.93 R57.2
N$21
  Top 0.406: Q9.1 42.17,53.93 R34.1 43.62,52.92 45.19,51.36 45.58,51.36 R33.2
N$22
  Top 0.406: Q11.1 34.55,76.79 R37.1 R40.1
N$23
  Top 0.406: Q12.1 44.71,76.79 R41.1 R42.1
N$24
  Top 0.406: R39.1 R38.1 25.4,76.74 Q10.1
N$25
  Top 0.406: Q13.1 54.87,76.79 R43.1 R44.1
N$26
  Top 0.406: Q14.1 25.4,94.52 R45.1 R46.1
N$27
  Top 0.406: Q15.1 34.55,94.57 R47.1 R48.1
N$28
  Top 0.406: R58.2 81.6,120.75 LED3.C
P1  (via drill 0.6)
  Top 0.406: v27.89,72.31 27.89,74.03 R39.2
  Bottom 0.406: U$2.37 36.7,63.5 v27.89,72.31
P1+  (via drill 0.6)
  Top 0.813: Q10.2 30.66,77.75 v30.71,77.8
  Bottom 0.813: v30.71,77.8 30.53,77.8 29.39,76.66 19.23,76.66 PIXEL1-4.8 17.78,76.84 PIXEL1-4.7
P2  (via drill 0.6)
  Top 0.406: v59.69,62.23 53.31,68.6 40.11,68.6 40.11,68.63 38.08,70.66 38.08,74.06 R40.2
  Bottom 0.406: U$2.36 77.47,59.69 76.2,58.42 63.5,58.42 v59.69,62.23
P2+  (via drill 0.6)
  Top 0.813: Q11.2 40.79,77.75 v40.84,77.8
  Bottom 0.813: v40.84,77.8 39.9,77.8 35.74,81.97 19.1,81.97 PIXEL1-4.4 18.36,81.91 17.45,81 16.87,81 PIXEL1-4.5
P3  (via drill 0.6)
  Top 0.406: v48.26,70.59 R42.2
  Bottom 0.406: U$2.35 74.93,66.04 52.81,66.04 v48.26,70.59
P3+  (via drill 0.6)
  Top 0.813: Q12.2 51.31,77.75 v51.33,77.78
  Bottom 0.813: v51.33,77.78 51.33,78.21 45.08,84.46 PIXEL1-4.2 19.05,84.48 17.4,86.13 16.92,86.13 PIXEL1-4.1
P4  (via drill 0.6)
  Top 0.406: 65.99,57.2 v66.04,57.15 66.12,57.23 66.12,57.73 61.9,61.95 61.9,70.56 58.76,73.7 58.76,74.08 R44.2
  Bottom 0.406: v66.04,57.15 77.47,57.15 80.01,59.69 U$2.34
P4+  (via drill 0.6)
  Top 0.813: Q13.2 61.32,77.75 v61.37,77.8 | PIXEL1-4.3 15.88,83.19 14.43,81.61 14.43,76.76 16.51,74.93 20.32,74.93 21.59,76.2 21.59,78.08 20.32,79.35 19.07,79.35 PIXEL1-4.6
  Bottom 0.813: v61.37,77.8 61.29,77.8 59.69,76.2 35.33,76.2 32.18,79.35 19.07,79.35 PIXEL1-4.6
P5  (via drill 0.6)
  Top 0.406: v27.94,90.17 R46.2
  Bottom 0.406: v27.94,90.17 27.94,88.9 30.48,86.36 57.15,86.36 U$2.33
P5+  (via drill 0.6)
  Top 0.813: Q14.2 30.79,95.53 v30.89,95.63
  Bottom 0.813: v30.89,95.63 30.76,95.63 29.74,94.62 PIXEL5-8.8 18.41,93.98 17.78,93.98 16.51,95.25 PIXEL5-8.7
P6  (via drill 0.6)
  Top 0.406: v38.1,90.17 R48.2 | v62.97,83.06 62.97,62.76 v69.85,55.88
  Bottom 0.406: v38.1,90.17 38.1,88.9 39.37,87.63 58.42,87.63 58.42,87.6 v62.97,83.06 | v69.85,55.88 78.74,55.88 82.55,59.69 U$2.32
P6+  (via drill 0.6)
  Top 0.813: Q15.2 41.25,95.53 v41.3,95.58
  Bottom 0.813: v41.3,95.58 40.64,95.58 36.53,99.69 PIXEL5-8.4 17.78,99.69 PIXEL5-8.5
P7  (via drill 0.6)
  Top 0.406: v48.26,90.17 R23.2
  Bottom 0.406: v48.26,90.17 49.53,88.9 59.69,88.9 82.55,66.04 U$2.31
P7+  (via drill 0.6)
  Top 0.813: Q16.2 51.13,95.53 v51.18,95.58
  Bottom 0.813: v51.18,95.58 51.18,95.83 44.75,102.26 19.07,102.26 PIXEL5-8.2 18.62,102.24 17.02,103.84 16.84,103.84 PIXEL5-8.1
P8
  Top 0.406: U$2.26 90.17,58.42 86.36,54.61 73.66,54.61 64.26,64.01 64.26,86.08 58.48,91.86 R29.2
P8+  (via drill 0.6)
  Top 0.813: Q17.2 61.29,95.53 v61.32,95.5 | PIXEL5-8.3 15.88,100.97 14.43,99.49 14.43,94.41 16.51,92.71 20.32,92.71 21.59,93.98 21.59,96.01 20.32,97.28 19.18,97.28 PIXEL5-8.6
  Bottom 0.813: v61.32,95.5 61.21,95.5 59.69,93.98 35.56,93.98 32.26,97.28 19.18,97.28 PIXEL5-8.6
P9
  Top 0.406: U$2.0 54.61,64.77 52.07,67.31 21.59,67.31 13.18,75.67 13.11,103.35 17.78,107.95 26.67,107.95 27.94,109.22 R49.2
P9+  (via drill 0.6)
  Top 0.813: Q18.2 30.99,113.31 v31.01,113.34
  Bottom 0.813: v31.01,113.34 29.24,113.34 28.25,112.34 19.1,112.34 PIXEL9-12.8 18.8,112.14 17.65,112.14 16.51,113.28 PIXEL9-12.7
P10  (via drill 0.6)
  Top 0.406: R51.2 38.1,107.95 39.37,106.68 60.63,106.68 63.02,104.29 63.02,89.84 66.7,86.16 66.7,64.11 68.58,62.23 68.77,62.04 74.93,55.88 v85.09,55.88 | v90.17,55.88 92.71,58.42 U$2.24
  Bottom 0.406: v85.09,55.88 v90.17,55.88
P10+  (via drill 0.6)
  Top 0.813: Q19.2 41.25,113.31 v41.28,113.34
  Bottom 0.813: v41.28,113.34 40.41,113.34 36.27,117.47 PIXEL9-12.4 18.47,117.47 17.17,116.18 16.54,116.18 PIXEL9-12.5
P11
  Top 0.406: R53.2 48.26,109.22 49.53,107.95 61.57,107.95 64.92,104.6 64.92,90.53 68.66,86.79 68.66,64.01 75.56,57.1 84.58,57.1 87.88,60.4 87.88,60.71 U$2.28
P11+  (via drill 0.6)
  Top 0.813: Q20.2 51.46,113.31 v51.54,113.39
  Bottom 0.813: v51.54,113.39 51.49,113.39 44.78,120.09 19.13,120.09 PIXEL9-12.2 17.78,121.28 PIXEL9-12.1
P12
  Top 0.406: U$2.27 85.09,66.04 80.01,66.04 71.45,74.6 71.12,74.93 70.16,75.9 70.16,87.58 66.42,91.31 66.42,105.38 62.17,109.64 R55.2
P12+  (via drill 0.6)
  Top 0.813: v61.47,113.39 59.51,113.39 Q21.2 | PIXEL9-12.3 15.88,118.75 13.97,116.84 13.97,113.03 16.51,110.49 20.32,110.49 21.59,111.76 21.59,113.66 20.32,114.94 PIXEL9-12.6
  Bottom 0.813: PIXEL9-12.6 33.83,114.94 37.95,110.82 58.9,110.82 v61.47,113.39
PWM_B1  (via drill 0.6)
  Top 0.406: v40.31,15.29 42.81,15.29 R15.2
  Bottom 0.406: U$2.14 45.34,20.32 v40.31,15.29
PWM_B2  (via drill 0.6)
  Top 0.406: v40.64,33.02 42.76,33.02 R25.2
  Bottom 0.406: U$2.8 45.72,38.1 v40.64,33.02
PWM_B3  (via drill 0.6)
  Top 0.406: v40.26,51.08 43.04,51.08 R34.2
  Bottom 0.406: U$2.3 42.52,53.34 v40.26,51.08
PWM_G1  (via drill 0.6)
  Top 0.406: v31.83,15.34 33.97,15.34 R12.2
  Bottom 0.406: U$2.12 44.42,27.94 v31.83,15.34
PWM_G2  (via drill 0.6)
  Top 0.406: v31.55,33.22 34.07,33.22 R22.2
  Bottom 0.406: U$2.7 41.5,43.18 v31.55,33.22
PWM_G3  (via drill 0.6)
  Top 0.406: v31.75,50.98 34.05,50.98 R31.2
  Bottom 0.406: U$2.2 36.65,55.88 v31.75,50.98
PWM_R1  (via drill 0.6)
  Top 0.406: v22.86,15.24 24.98,15.24 R17.2
  Bottom 0.406: U$2.11 38.1,30.48 v22.86,15.24
PWM_R2  (via drill 0.6)
  Top 0.406: v22.45,33.3 25.26,33.3 R19.2
  Bottom 0.406: U$2.6 34.87,45.72 v22.45,33.3
PWM_R3  (via drill 0.6)
  Top 0.406: v22.63,50.98 25.16,50.98 R28.2
  Bottom 0.406: U$2.1 30.07,58.42 v22.63,50.98
R1
  Top 0.813: PWM1.1 17.78,27.3 PWM1.2 26.07,26.04 Q1.2
R2
  Top 0.813: Q4.2 19.64,44.41 PWM2.2 17.78,45.09 PWM2.1
R3
  Top 0.813: PWM3.1 17.78,62.87 PWM3.2 26.07,61.59 Q7.2
RX  (via drill 0.6)
  Top 0.406: IC3.1 98.42,113.44 v98.37,113.39 | v98.4,95.66 98.4,97.71 IC1.1 | v93.8,95.71 87.27,89.18 87.27,72.41 v87.66,72.03
  Bottom 0.406: v98.37,113.39 98.37,95.68 v98.4,95.66 98.35,95.71 v93.8,95.71 | U$2.30 87.86,58.19 92.15,58.19 95.1,61.14 95.1,64.82 93.22,66.7 93.22,66.73 92.96,66.73 v87.66,72.03
RX_EN1
  Top 0.406: IC3.2 99.7,112.07 R10.2 98.82,111.68 98.17,111.68 95.33,108.84 95.33,95.17 88.9,88.75 88.9,64.77 U$2.25
RX_EN2
  Top 0.406: IC1.2 99.7,94.29 R3.2 98.77,93.96 98.55,93.96 92.56,87.96 92.56,87.94 91.75,87.12 91.75,69.22 95.68,65.28 95.68,58.85 U$2.21 95.25,58.75
SCL
  Top 0.406: U$3.7 102.23,86.79 101.37,87.66 97.87,87.66 95.25,85.04 95.25,80.01 96.1,79.16 R36.2 99.52,76.16 99.52,56.44 95.89,52.81 60.02,52.81 55.37,48.16 54.71,48.16 U$2.5
SDA
  Top 0.406: U$3.1 100.97,79.27 100.28,78.59 100.1,78.59 | R35.2 99.63,78.59 100.1,78.59 | 100.1,78.59 100.74,77.95 100.74,55.5 96.22,50.98 64.95,50.98 58.42,44.45 58.42,38.1 55.88,35.56 U$2.9 54.71,35.66
TX  (via drill 0.6)
  Top 0.406: IC3.4 102.23,113.51 v102.18,113.46 | v102.18,95.63 102.18,97.68 IC1.4 | v90.09,94.36 86.26,90.53 86.23,90.53 85.88,90.17 85.88,68.78 v86.34,68.33 86.26,68.4
  Bottom 0.406: v102.18,95.63 v102.18,113.46 | v102.18,95.63 102.23,95.58 | 85.09,65.13 U$2.29 84.94,63.65 84.94,66.93 v86.34,68.33 | v90.09,94.36 100.91,94.36 v102.18,95.63
TX_EN1
  Top 0.406: IC3.3 100.97,112.07 R11.2 101.84,111.68 102.82,111.68 104.72,109.78 104.72,108.69 102.54,106.5 99.16,106.5 96.65,103.99 96.65,94.41 90.22,87.99 90.22,65.99 U$2.23
TX_EN2
  Top 0.406: IC1.3 100.97,94.29 R4.2 101.9,93.96 102.44,93.96 104.29,92.1 104.29,90.45 102.79,88.95 97.33,88.95 93.5,85.52 93.5,69.16 97.79,64.77 97.79,57 96.65,55.85 95.28,55.85 U$2.22

### Text on the board
tNames: LED CONTROLLER v1.0 | NIT WHIPS : BURNING MAN 2011